# EAGLE design M101 (EAGLE 6.6.0)
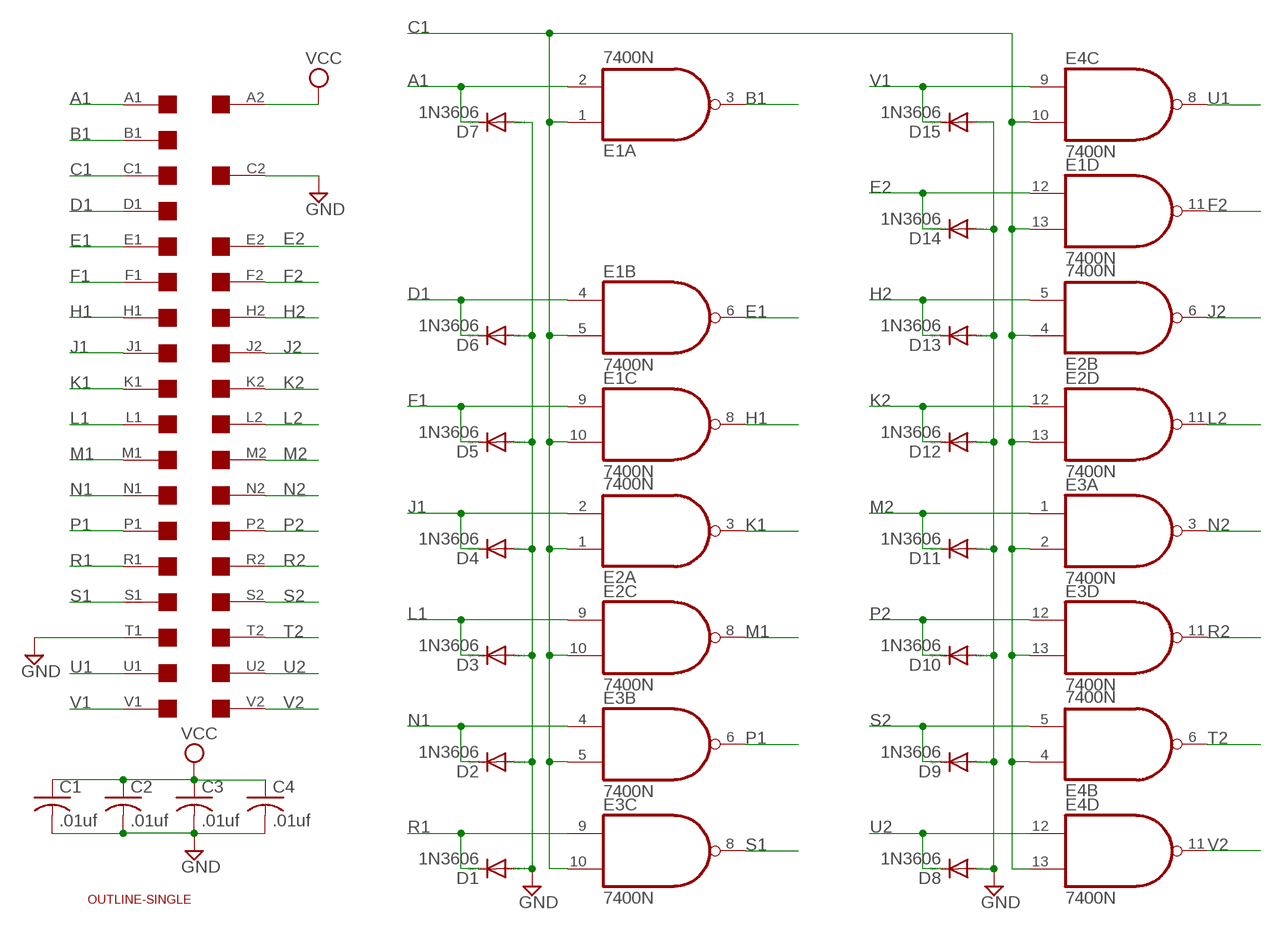
[diagram p0: schematic, sheet 1]

## Parts
C1  .01uf  C-US050-025X075  [C050-025X075]
C2  .01uf  C-US050-025X075  [C050-025X075]
C3  .01uf  C-US050-025X075  [C050-025X075]
C4  .01uf  C-US050-025X075  [C050-025X075]
D1  1N3606  1N4148DO35-10  [DO35-10]
D2  1N3606  1N4148DO35-10  [DO35-10]
D3  1N3606  1N4148DO35-10  [DO35-10]
D4  1N3606  1N4148DO35-10  [DO35-10]
D5  1N3606  1N4148DO35-10  [DO35-10]
D6  1N3606  1N4148DO35-10  [DO35-10]
D7  1N3606  1N4148DO35-10  [DO35-10]
D8  1N3606  1N4148DO35-10  [DO35-10]
D9  1N3606  1N4148DO35-10  [DO35-10]
D10  1N3606  1N4148DO35-10  [DO35-10]
D11  1N3606  1N4148DO35-10  [DO35-10]
D12  1N3606  1N4148DO35-10  [DO35-10]
D13  1N3606  1N4148DO35-10  [DO35-10]
D14  1N3606  1N4148DO35-10  [DO35-10]
D15  1N3606  1N4148DO35-10  [DO35-10]
E1  7400N  [DIL14]
E2  7400N  [DIL14]
E3  7400N  [DIL14]
E4  7400N  [DIL14]
U$1  SINGLE  [EDGE-CON2]
U$4  OUTLINE-SINGLE  [SINGLE]

## Nets
A1: D7.C E1.2(A:I1) U$1.A1
B1: E1.3(A:O) U$1.B1
C1: E1.1(A:I0) E1.5(B:I1) E1.10(C:I1) E1.13(D:I1) E2.1(A:I0) E2.4(B:I0) E2.10(C:I1) E2.13(D:I1) E3.2(A:I1) E3.5(B:I1) E3.10(C:I1) E3.13(D:I1) E4.4(B:I0) E4.10(C:I1) E4.13(D:I1) U$1.C1
D1: D6.C E1.4(B:I0) U$1.D1
E1: E1.6(B:O) U$1.E1
E2: D14.C E1.12(D:I0) U$1.E2
F1: D5.C E1.9(C:I0) U$1.F1
F2: E1.11(D:O) U$1.F2
GND: C1.2 C2.2 C3.2 C4.2 D1.A D2.A D3.A D4.A D5.A D6.A D7.A D8.A D9.A D10.A D11.A D12.A D13.A D14.A D15.A U$1.C2 U$1.T1
H1: E1.8(C:O) U$1.H1
H2: D13.C E2.5(B:I1) U$1.H2
J1: D4.C E2.2(A:I1) U$1.J1
J2: E2.6(B:O) U$1.J2
K1: E2.3(A:O) U$1.K1
K2: D12.C E2.12(D:I0) U$1.K2
L1: D3.C E2.9(C:I0) U$1.L1
L2: E2.11(D:O) U$1.L2
M1: E2.8(C:O) U$1.M1
M2: D11.C E3.1(A:I0) U$1.M2
N1: D2.C E3.4(B:I0) U$1.N1
N2: E3.3(A:O) U$1.N2
P1: E3.6(B:O) U$1.P1
P2: D10.C E3.12(D:I0) U$1.P2
R1: D1.C E3.9(C:I0) U$1.R1
R2: E3.11(D:O) U$1.R2
S1: E3.8(C:O) U$1.S1
S2: D9.C E4.5(B:I1) U$1.S2
T2: E4.6(B:O) U$1.T2
U1: E4.8(C:O) U$1.U1
U2: D8.C E4.12(D:I0) U$1.U2
V1: D15.C E4.9(C:I0) U$1.V1
V2: E4.11(D:O) U$1.V2
VCC: C1.1 C2.1 C3.1 C4.1 U$1.A2
Unconnected: E4.1(A:I0) E4.2(A:I1) E4.3(A:O) U$1.B2 U$1.D2

## Power pins joined to a net without a drawn wire
GND: E1.7(P:GND) E2.7(P:GND) E3.7(P:GND) E4.7(P:GND)
VCC: E1.14(P:VCC) E2.14(P:VCC) E3.14(P:VCC) E4.14(P:VCC)

## Library data of the parts
C1-C4 = rcl:C-US: CAPACITOR, American symbol
D1-D15 = diode:1N4148: DIODE high speed (Philips)
E1-E4 = 74xx-us:74*00: Quad 2-input NAND gate
U$1 = dec-con:SINGLE: Single-Height DEC board
U$4 = dec-con:OUTLINE-*: Board outlines for DEC boards.

## Board
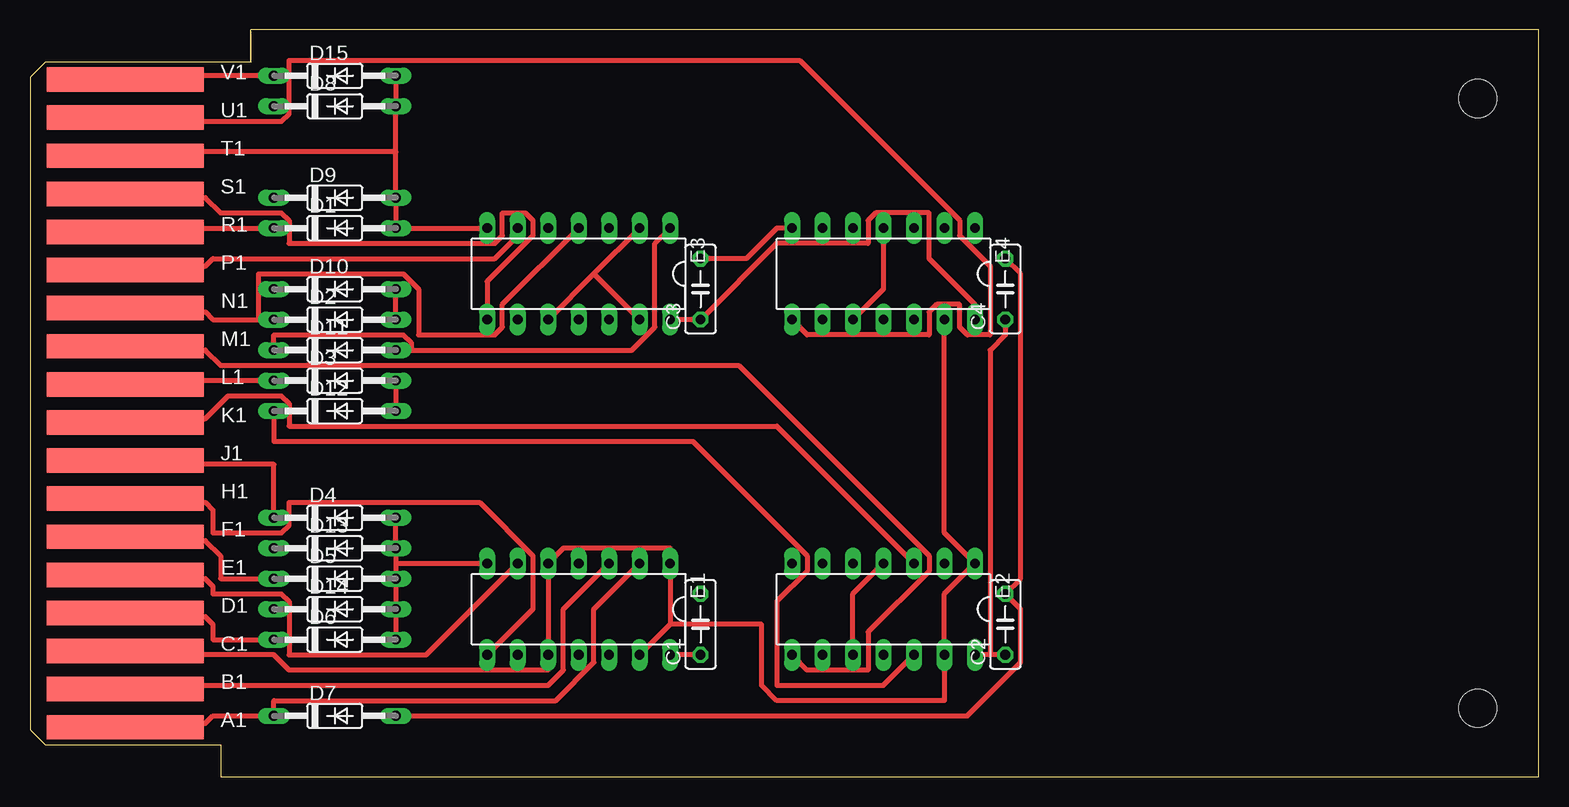
[diagram p1: board, top side]
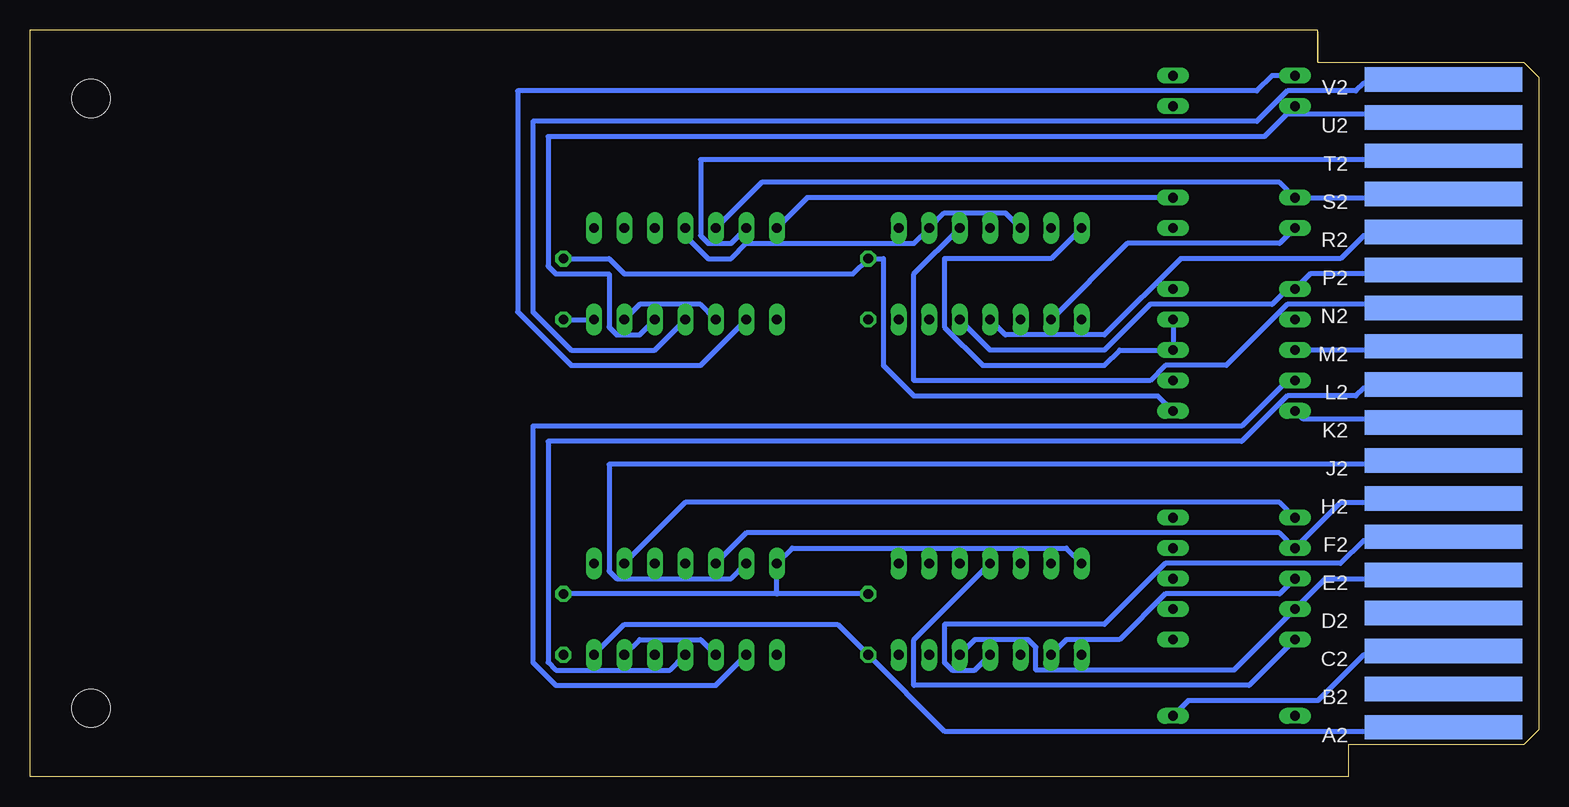
[diagram p2: board, bottom side, seen from below]

Size 125.73 x 62.23 mm. Coordinates in mm from the lower left corner, seen from the top.
Copper layers (1+16): Top 0.035mm / dielectric 1.5mm / Bottom 0.035mm
Design rules "16mils": minimum track width 16mil, minimum drill 32mil, track to track 15mil, track to pad 10mil, pad to pad 10mil, via to via 10mil, smd to smd 10mil, copper to edge 13mil, drill to drill 10mil, minimum pad ring 10mil, minimum via ring 8mil, stop-mask expansion 0mil, vias tented up to drill 0mil, thermal gap 10mil

### Footprints (pad centres in the part's own frame; a part is rotated, then mirrored left to right if it is on the bottom)
C050-025X075 = drill 0.813 octagon: 1 -2.54,0; 2 2.54,0
DO35-10 = drill 0.813 long: A 5.08,0; C -5.08,0
DIL14 = drill 0.813 long: 1 -7.62,-3.81; 2 -5.08,-3.81; 3 -2.54,-3.81; 4 0,-3.81; 5 2.54,-3.81; 6 5.08,-3.81; 7 7.62,-3.81; 8 7.62,3.81; 9 5.08,3.81; 10 2.54,3.81; 11 0,3.81; 12 -2.54,3.81; 13 -5.08,3.81; 14 -7.62,3.81
EDGE-CON2 = smd 13.106 x 2.032: A1 7.938,4.128; B1 7.938,7.303; C1 7.938,10.477; D1 7.938,13.652; E1 7.938,16.828; F1 7.938,20.003; H1 7.938,23.177; J1 7.938,26.352; K1 7.938,29.527; L1 7.938,32.703; M1 7.938,35.877; N1 7.938,39.053; P1 7.938,42.227; R1 7.938,45.403; S1 7.938,48.578; T1 7.938,51.752; U1 7.938,54.928; V1 7.938,58.102 | smd 13.106 x 2.032 bottom: A2 7.938,4.128; B2 7.938,7.303; C2 7.938,10.477; D2 7.938,13.652; E2 7.938,16.828; F2 7.938,20.003; H2 7.938,23.177; J2 7.938,26.352; K2 7.938,29.527; L2 7.938,32.703; M2 7.938,35.877; N2 7.938,39.053; P2 7.938,42.227; R2 7.938,45.403; S2 7.938,48.578; T2 7.938,51.752; U2 7.938,54.928; V2 7.938,58.102
SINGLE = hole 3.175: 120.65,56.515; 120.65,5.715

### Placement (x,y rotation side)
C1  55.88,12.7 90 top
C2  81.28,12.7 90 top
C3  55.88,40.64 90 top
C4  81.28,40.64 90 top
D1  25.4,45.72 0 top
D2  25.4,38.1 0 top
D3  25.4,33.02 0 top
D4  25.4,21.59 0 top
D5  25.4,16.51 0 top
D6  25.4,11.43 0 top
D7  25.4,5.08 0 top
D8  25.4,55.88 0 top
D9  25.4,48.26 0 top
D10  25.4,40.64 0 top
D11  25.4,35.56 0 top
D12  25.4,30.48 0 top
D13  25.4,19.05 0 top
D14  25.4,13.97 0 top
D15  25.4,58.42 0 top
E1  45.72,13.97 180 top
E2  71.12,13.97 180 top
E3  45.72,41.91 180 top
E4  71.12,41.91 180 top
U$1  0,0 0 top
U$4  0,0 0 top

### Tracks (layer width: path | path; a pad name or v marks a point on that pad's centre or on a via)
A1
  Top 0.406: U$1.A1 8.26,4.45 14.61,4.45 15.24,5.08 D7.C 20.32,6.35 43.82,6.35 46.99,9.53 46.99,13.97 E1.2
B1
  Top 0.406: E1.3 44.45,13.97 44.45,8.89 43.18,7.62 8.26,7.62 U$1.B1
C1
  Top 0.406: E3.2 46.99,41.91 | 46.99,41.91 E3.10 | 46.99,41.91 E3.13 | E4.10 71.12,40.64 E4.4 | E2.4 68.58,15.24 E2.10 | U$1.C1 8.26,10.16 20.32,10.16 21.59,8.89 43.18,8.89 E1.10 E1.5 44.45,19.05 53.34,19.05 E1.1 53.34,12.7 | E4.13 76.2,20.32 E2.1 76.2,15.24 E2.13 76.2,6.35 62.23,6.35 60.96,7.62 60.96,12.7 53.34,12.7 | 53.34,12.7 E1.13
  Bottom 0.406: E3.5 44.45,46.99 49.53,46.99 E3.2 52.07,44.45 66.04,44.45 67.31,43.18 69.22,43.18 71.12,45.09 E4.4 | E4.13 74.93,39.37 69.85,39.37 E4.10 | E2.10 69.85,11.43 74.93,11.43 E2.13
D1
  Top 0.406: D6.C 15.24,11.43 15.24,12.7 14.61,13.34 8.26,13.34 U$1.D1
  Bottom 0.406: E1.4 52.07,11.43 52.07,7.62 24.13,7.62 D6.C
E1
  Top 0.406: E1.6 33.02,10.16 21.59,10.16 21.59,14.61 20.96,15.24 15.24,15.24 15.24,15.88 14.61,16.51 8.26,16.51 U$1.E1
E2
  Bottom 0.406: E1.12 46.99,11.43 42.55,11.43 41.91,10.79 41.91,8.89 25.4,8.89 D14.C 17.78,16.51 8.26,16.51 U$1.E2
F1
  Top 0.406: D5.C 15.88,16.51 15.88,18.41 14.61,19.68 8.26,19.68 U$1.F1
  Bottom 0.406: E1.9 39.37,11.43 34.93,11.43 31.12,15.24 21.59,15.24 D5.C
F2
  Bottom 0.406: E1.11 46.99,8.89 48.9,8.89 49.53,9.53 49.53,12.7 36.2,12.7 31.12,17.78 16.51,17.78 14.61,19.68 8.26,19.68 U$1.F2
GND
  Top 0.406: D3.A D12.A | C3.2 59.69,43.18 62.23,45.72 E4.7 | D2.A D10.A | D15.A D8.A 30.48,52.07 | E3.7 D1.A D9.A 30.48,52.07 | 30.48,52.07 8.26,52.07 U$1.T1 | D6.A D14.A D5.A 30.48,17.78 | 30.48,17.78 D13.A D4.A | 30.48,17.78 E1.7 | C4.2 82.55,41.91 82.55,16.51 C2.2 82.55,13.97 82.55,9.53 78.11,5.08 D7.A
  Bottom 0.406: D12.A 31.75,31.75 52.07,31.75 54.61,34.29 54.61,43.18 C3.2 57.15,41.91 76.2,41.91 77.47,43.18 C4.2 | D2.A D11.A 34.93,35.56 36.2,34.29 46.36,34.29 49.53,37.47 49.53,43.18 40.64,43.18 E3.7 | E4.7 60.96,48.26 D9.A | D7.A 29.21,6.35 18.42,6.35 14.61,10.16 8.26,10.16 U$1.C2 | C1.2 63.5,15.24 | 63.5,15.24 C2.2 | E1.7 39.37,19.05 62.23,19.05 E2.7 63.5,15.24
H1
  Top 0.406: E1.8 41.91,13.97 41.91,18.41 37.47,22.86 21.59,22.86 21.59,20.95 20.96,20.32 15.24,20.32 15.24,22.23 14.61,22.86 8.26,22.86 U$1.H1
H2
  Bottom 0.406: E2.5 66.04,20.32 21.59,20.32 D13.C 16.51,22.86 8.26,22.86 U$1.H2
J1
  Top 0.406: D4.C 20.32,26.04 8.26,26.04 U$1.J1
  Bottom 0.406: E2.2 71.12,22.86 21.59,22.86 D4.C
J2
  Bottom 0.406: E2.6 67.31,16.51 76.84,16.51 77.47,17.14 77.47,26.04 8.26,26.04 U$1.J2
K1
  Top 0.406: E2.3 62.23,29.21 21.59,29.21 21.59,31.11 20.96,31.75 16.51,31.75 14.61,29.84 8.26,29.84 U$1.K1
K2
  Top 0.406: E2.12 71.12,7.62 62.23,7.62 62.23,14.61 64.77,17.14 64.77,18.41 55.25,27.94 20.32,27.94 D12.C
  Bottom 0.406: D12.C 19.69,29.84 8.26,29.84 U$1.K2
L1
  Top 0.406: D3.C 8.26,33.02 U$1.L1
  Bottom 0.406: E2.9 68.58,7.62 81.92,7.62 83.82,9.53 83.82,29.21 24.77,29.21 20.96,33.02 D3.C
L2
  Bottom 0.406: E2.11 72.39,8.89 81.92,8.89 82.55,9.53 82.55,27.94 24.77,27.94 20.96,31.75 15.24,31.75 14.61,32.38 8.26,32.38 U$1.L2
M1
  Top 0.406: E2.8 64.77,8.89 69.85,8.89 69.85,12.06 74.93,17.14 74.93,18.41 59.06,34.29 15.88,34.29 14.61,35.56 8.26,35.56 U$1.M1
M2
  Top 0.406: E3.1 52.07,44.45 52.07,37.47 50.17,35.56 31.75,35.56 31.75,36.2 31.12,36.83 20.32,36.83 D11.C
  Bottom 0.406: D11.C 8.26,35.56 U$1.M2
N1
  Top 0.406: 19.05,38.1 15.24,38.1 14.61,38.73 8.26,38.73 U$1.N1 | 19.05,38.1 D2.C | E3.4 39.37,39.37 39.37,37.47 38.74,36.83 32.39,36.83 32.39,40.64 31.12,41.91 19.05,41.91 19.05,38.1
N2
  Bottom 0.406: E3.3 52.07,41.91 52.07,33.02 32.39,33.02 31.12,34.29 26.04,34.29 20.96,39.37 8.26,39.37 U$1.N2
P1
  Top 0.406: E3.6 40.64,45.09 38.74,43.18 15.24,43.18 14.61,42.55 8.26,42.55 U$1.P1
P2
  Bottom 0.406: E3.12 45.72,35.56 36.2,35.56 32.39,39.37 22.23,39.37 20.96,40.64 D10.C 19.05,41.91 8.26,41.91 U$1.P2
R1
  Top 0.406: D1.C 8.26,45.72 U$1.R1
  Bottom 0.406: E3.9 34.29,44.45 21.59,44.45 D1.C
R2
  Bottom 0.406: E3.11 44.45,36.83 36.2,36.83 29.85,43.18 16.51,43.18 14.61,45.09 8.26,45.09 U$1.R2
S1
  Top 0.406: E3.8 38.1,41.27 41.91,45.09 41.91,46.35 41.28,46.99 39.37,46.99 39.37,45.09 38.74,44.45 21.59,44.45 21.59,46.35 20.96,46.99 15.88,46.99 14.61,48.26 8.26,48.26 U$1.S1
S2
  Bottom 0.406: E4.5 64.77,49.53 21.59,49.53 D9.C 8.26,48.26 U$1.S2
T2
  Bottom 0.406: E4.6 67.31,44.45 69.22,44.45 69.85,45.09 69.85,51.44 8.26,51.44 U$1.T2
U1
  Top 0.406: E4.8 64.77,36.83 74.93,36.83 74.93,38.73 75.57,39.37 77.47,39.37 77.47,37.47 78.11,36.83 80.01,36.83 80.01,42.55 77.47,45.09 77.47,46.35 64.14,59.69 21.59,59.69 21.59,55.24 20.96,54.61 8.26,54.61 U$1.U1
U2
  Bottom 0.406: E4.12 74.93,36.83 76.84,36.83 77.47,37.47 77.47,41.91 81.92,41.91 82.55,42.55 82.55,53.34 22.86,53.34 20.96,55.24 | D8.C 20.96,55.24 | 20.96,55.24 8.26,55.24 U$1.U2
V1
  Top 0.406: D15.C 8.26,58.42 U$1.V1
  Bottom 0.406: E4.9 69.85,34.29 80.65,34.29 85.09,38.73 85.09,57.15 23.5,57.15 22.23,58.42 D15.C
V2
  Bottom 0.406: E4.11 73.66,35.56 80.65,35.56 83.82,38.73 83.82,54.61 23.5,54.61 20.96,57.15 15.24,57.15 14.61,57.78 8.26,57.78 U$1.V2
VCC
  Top 0.406: C1.1 E1.14 | C2.1 80.01,10.16 | 80.01,10.16 E2.14 | E3.14 C3.1 62.23,44.45 69.85,44.45 69.85,46.35 70.49,46.99 74.93,46.99 74.93,43.18 78.74,39.37 E4.14 | 80.01,10.16 80.01,35.56 81.28,36.83 C4.1
  Bottom 0.406: E2.14 76.2,12.7 58.42,12.7 C1.1 49.53,3.81 8.26,3.81 U$1.A2 | C4.1 E4.14